# Altium schematic sheet CPU.SchDoc
size A3
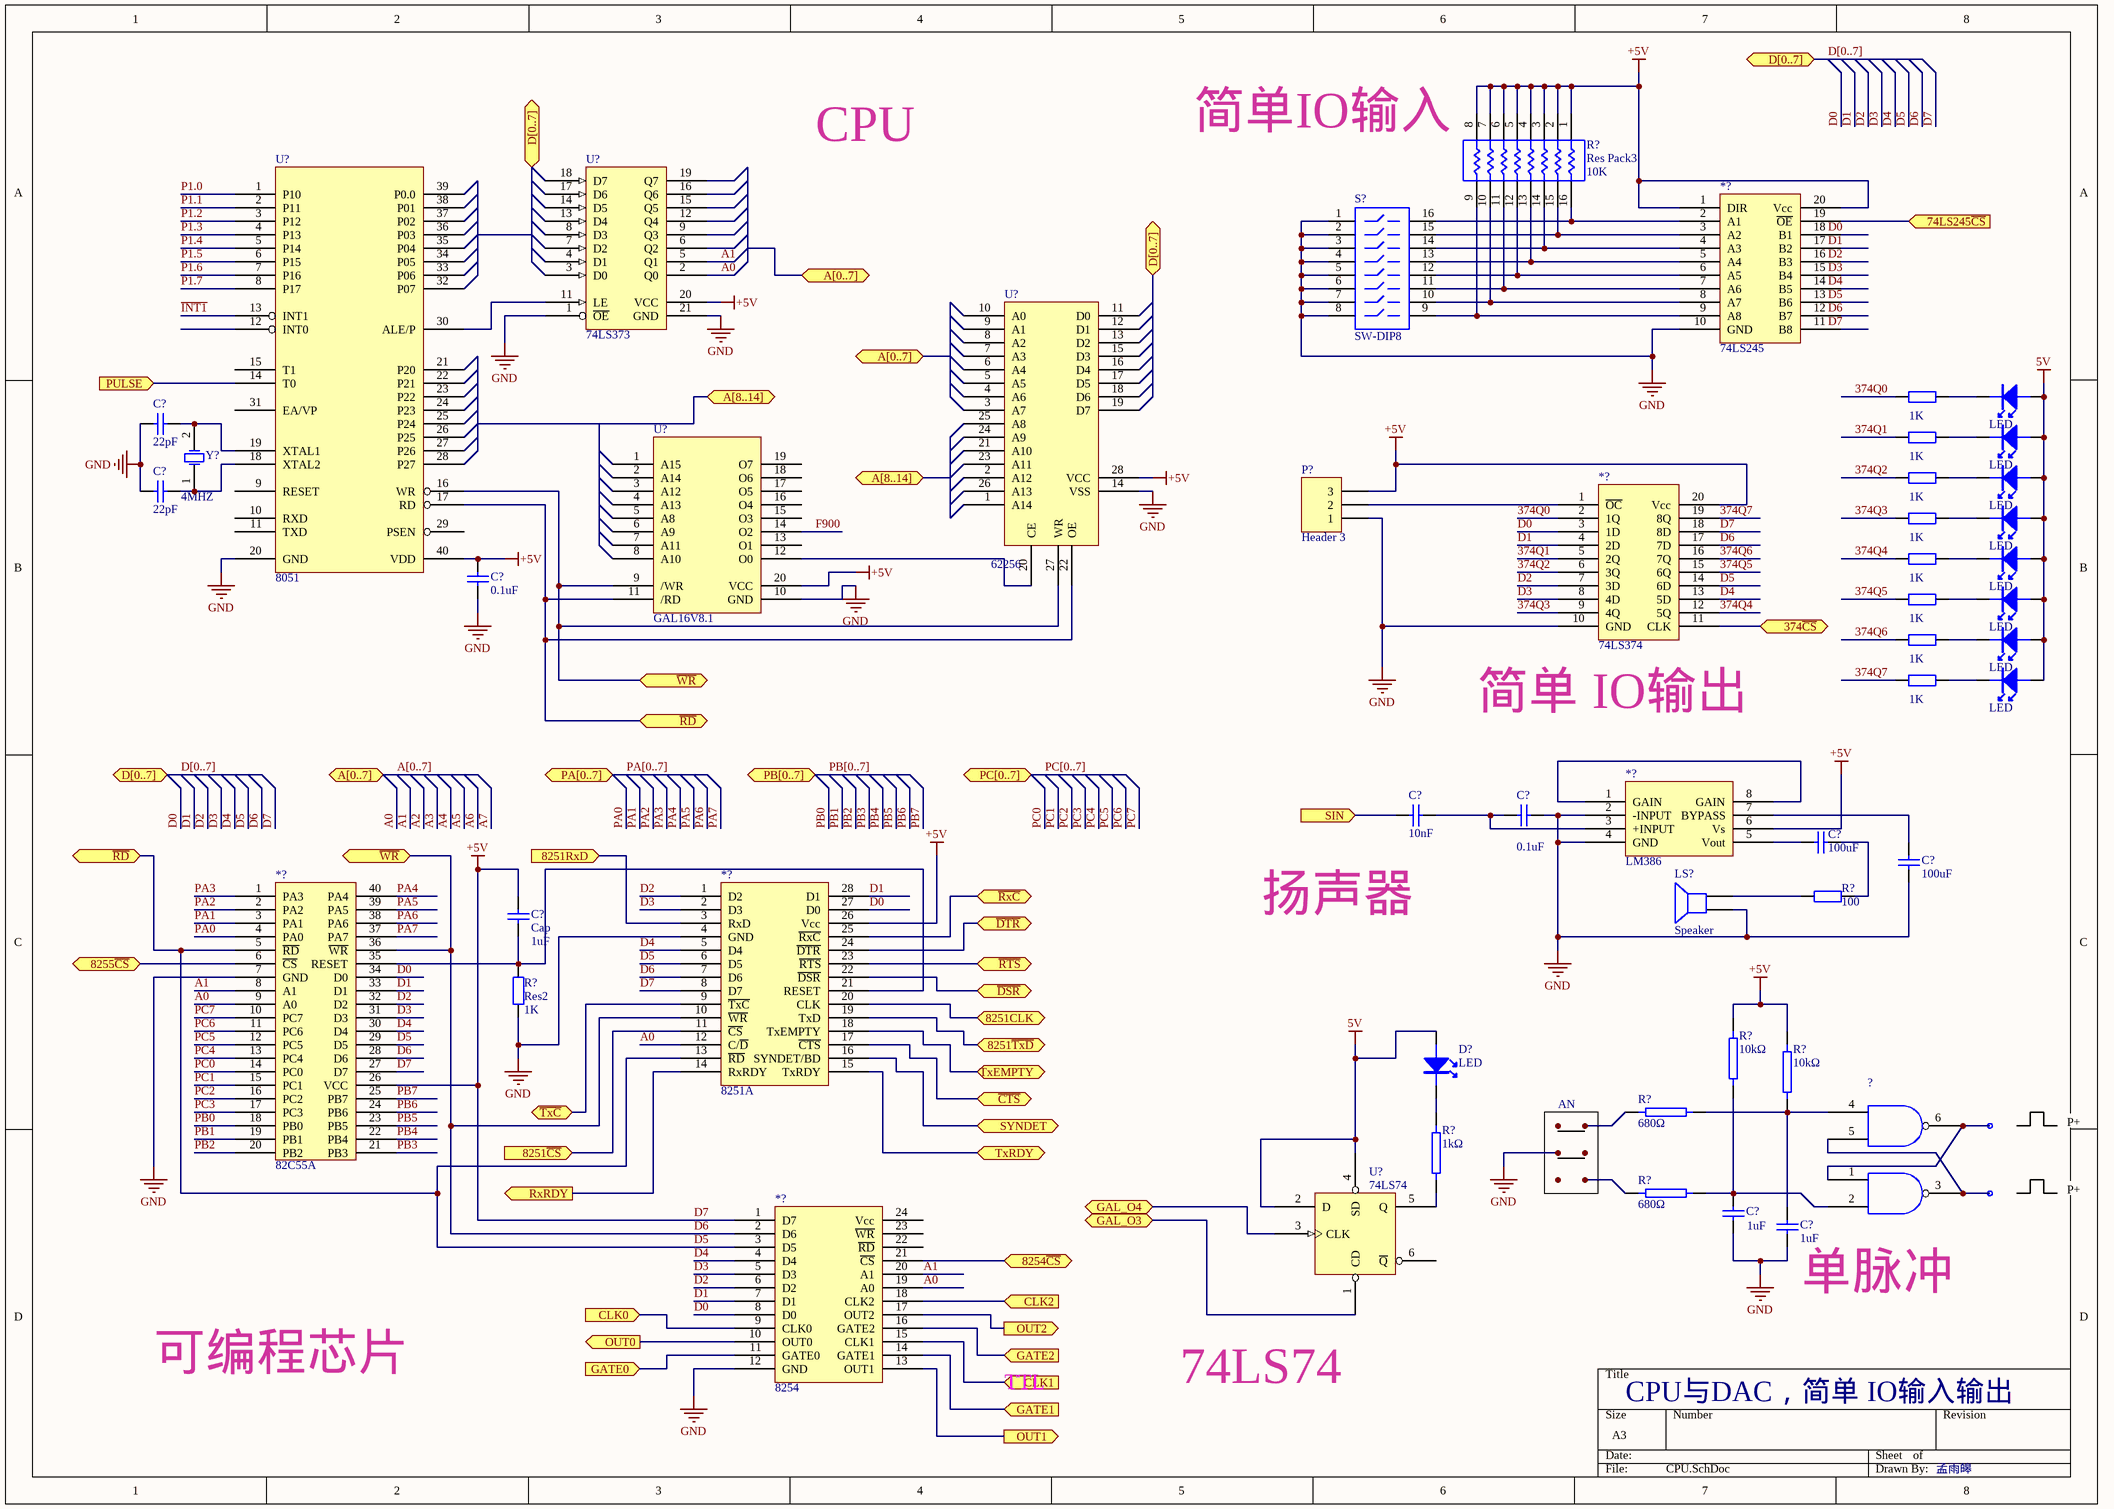
[diagram p0: CPU.SchDoc]

## Parts
(Parts that share a designator on the sheet are numbered #1, #2 ... from top to bottom, then left to right.)
*?#1  74LS245
*?#2  74LS374
*?#3  LM386
*?#4  8251A
*?#5  82C55A
*?#6  8254
?  74LS00  (value not drawn)
C?#1  value 22pF  [RAD-0.3]
C?#2  value 22pF  [RAD-0.3]
C?#3  value 0.1uF  [RAD-0.3]
C?#4  value 0.1uF  [RAD-0.3]
C?#5  value 10nF  [RAD-0.3]
C?#6  value 100uF  [RAD-0.3]
C?#7  value 100uF  [RAD-0.3]
C?#8  Cap  value 1uF  [RAD-0.3]
C?#9  value 1uF  [RAD-0.3]
C?#10  value 1uF  [RAD-0.3]
D?#1  LED
D?#2  LED
D?#3  LED
D?#4  LED
D?#5  LED
D?#6  LED
D?#7  LED
D?#8  LED
D?#9  LED
LS?  Speaker  [PIN2]
P?  Header 3  [HDR1X3]
R?#1  Res Pack3  value 10K  [SO-16_N]
R?#2  value 1K  [AXIAL-0.4]  (hidden comment: Res2)
R?#3  value 1K  [AXIAL-0.4]  (hidden comment: Res2)
R?#4  value 1K  [AXIAL-0.4]  (hidden comment: Res2)
R?#5  value 1K  [AXIAL-0.4]  (hidden comment: Res2)
R?#6  value 1K  [AXIAL-0.4]  (hidden comment: Res2)
R?#7  value 1K  [AXIAL-0.4]  (hidden comment: Res2)
R?#8  value 1K  [AXIAL-0.4]  (hidden comment: Res2)
R?#9  value 1K  [AXIAL-0.4]  (hidden comment: Res2)
R?#10  value 100  [AXIAL-0.4]
R?#11  Res2  value 1K  [AXIAL-0.4]
R?#12  10kΩ
R?#13  10kΩ
R?#14  680Ω
R?#15  1kΩ
R?#16  680Ω
S?  SW-DIP8  [DIP-16-KEY]
U?#1  74LS373
U?#2  62256
U?#3  8051
U?#4  GAL16V8.1
U?#5  74LS74
Y?  4MHZ  [crystals]

## Ports
74LS245~{CS} (in), 374~{CS}, 8251CLK, 8251RxD (in), 8251~{CS} (in), 8251~{TxD}, 8254~{CS}, 8255~{CS}, A[0..7], A[0..7] (bidir), A[8..14], CLK0 (in), CLK1 (in), CLK2 (in), D[0..7], D[0..7] (bidir), GAL_O3, GAL_O4, GATE0 (in), GATE1 (in), GATE2 (in), OUT0 (out), OUT1 (out), OUT2 (out), PA[0..7] (bidir), PB[0..7] (bidir), PC[0..7] (bidir), PULSE (in), RxRDY (out), SIN (in), SYNDET, TxEMPTY (bidir), TxRDY, ~{CTS}, ~{DSR}, ~{DTR} (bidir), ~{RD}, ~{RD} (bidir), ~{RTS} (bidir), ~{RxC}, ~{TxC}, ~{WR}

## Nets
5V: D?#1.1 D?#2.1 D?#3.1 D?#4.1 D?#5.1 D?#6.1 D?#7.1 D?#8.1 D?#9.1 U?#5.2(D) U?#5.4(SD)
D7: *?#1.1(DIR) *?#1.20(Vcc) *?#2.18(8D) *?#2.20(Vcc) *?#3.6(Vs) *?#4.8(D7) *?#4.26(Vcc) *?#5.26(VCC) *?#5.27(D7) *?#6.1(D7) C?#3.1 C?#8.1 P?.3 R?#1.1 R?#1.2 R?#1.3 R?#1.4 R?#1.5 R?#1.6 R?#1.7 R?#1.8 R?#12.2 R?#13.2 U?#1.20(VCC) U?#2.28(VCC) U?#3.40(VDD) U?#4.20(VCC)  [also labelled +5V]
GND: *?#1.10(GND) *?#2.10(GND) *?#3.2(-INPUT) *?#3.4(GND) *?#4.4(GND) *?#5.7(GND) *?#6.12(GND) C?#1.2 C?#2.2 C?#3.2 C?#4.2 C?#7.1 C?#9.1 C?#10.1 LS?.1 P?.1 R?#11.2 S?.1 S?.2 S?.3 S?.4 S?.5 S?.6 S?.7 S?.8 U?#1.1(~{OE}) U?#1.21(GND) U?#2.14(VSS) U?#3.20(GND) U?#4.10(GND)
74LS245~{CS}: *?#1.19(~{OE}) ; port 74LS245~{CS}
374~{CS}: *?#2.11(CLK) ; port 374~{CS}
374Q0: *?#2.2(1Q) R?#2.1
374Q1: *?#2.5(2Q) R?#3.1
374Q2: *?#2.6(3Q) R?#4.1
374Q3: *?#2.9(4Q) R?#5.1
374Q4: *?#2.12(5Q) R?#6.1
374Q5: *?#2.15(6Q) R?#7.1
374Q6: *?#2.16(7Q) R?#8.1
374Q7: *?#2.19(8Q) R?#9.1
8251~{CS}: *?#4.11(~{CS}) ; port 8251~{CS}
8251CLK: *?#4.20(CLK) ; port 8251CLK
8251RxD: *?#4.3(RxD) ; port 8251RxD
8251~{TxD}: *?#4.19(TxD) ; port 8251~{TxD}
8254~{CS}: *?#6.21(~{CS}) ; port 8254~{CS}
8255~{CS}: *?#5.6(~{CS}) ; port 8255~{CS}
A0: *?#4.12(C/~{D}) *?#5.9(A0) *?#6.19(A0) U?#1.2(Q0)
A1: *?#5.8(A1) *?#6.20(A1) U?#1.5(Q1)
~{CTS}: *?#4.17(~{CTS}) ; port ~{CTS}
CLK0: *?#6.9(CLK0) ; port CLK0
CLK1: *?#6.15(CLK1) ; port CLK1
CLK2: *?#6.18(CLK2) ; port CLK2
D0: *?#2.3(1D) *?#4.27(D0) *?#5.34(D0) *?#6.8(D0)
D1: *?#2.4(2D) *?#4.28(D1) *?#5.33(D1) *?#6.7(D1)
D2: *?#2.7(3D) *?#4.1(D2) *?#5.32(D2) *?#6.6(D2)
D3: *?#2.8(4D) *?#4.2(D3) *?#5.31(D3) *?#6.5(D3)
D4: *?#2.13(5D) *?#4.5(D4) *?#5.30(D4) *?#6.4(D4)
D5: *?#2.14(6D) *?#4.6(D5) *?#4.13(~{RD}) *?#5.5(~{RD}) *?#5.29(D5) *?#6.3(D5) U?#2.22(OE) U?#3.17(RD) U?#4.11(/RD) ; port ~{RD}
D6: *?#2.17(7D) *?#4.7(D6) *?#4.10(~{WR}) *?#5.28(D6) *?#5.36(~{WR}) *?#6.2(D6) U?#2.27(WR) U?#3.16(WR) U?#4.9(/WR) ; port ~{WR}
~{DSR}: *?#4.22(~{DSR}) ; port ~{DSR}
~{DTR}: *?#4.24(~{DTR}) ; port ~{DTR}
F900: U?#4.14(O2)
GAL_O3: U?#5.1(CD) ; port GAL_O3
GAL_O4: U?#5.3(CLK) ; port GAL_O4
GATE0: *?#6.11(GATE0) ; port GATE0
GATE1: *?#6.14(GATE1) ; port GATE1
GATE2: *?#6.16(GATE2) ; port GATE2
~{INT1}: U?#3.13(INT1)
OUT0: *?#6.10(OUT0) ; port OUT0
OUT1: *?#6.13(OUT1) ; port OUT1
OUT2: *?#6.17(OUT2) ; port OUT2
P1.0: U?#3.1(P10)
P1.1: U?#3.2(P11)
P1.2: U?#3.3(P12)
P1.3: U?#3.4(P13)
P1.4: U?#3.5(P14)
P1.5: U?#3.6(P15)
P1.6: U?#3.7(P16)
P1.7: U?#3.8(P17)
PA0: *?#5.4(PA0)
PA1: *?#5.3(PA1)
PA2: *?#5.2(PA2)
PA3: *?#5.1(PA3)
PA4: *?#5.40(PA4)
PA5: *?#5.39(PA5)
PA6: *?#5.38(PA6)
PA7: *?#5.37(PA7)
PB0: *?#5.18(PB0)
PB1: *?#5.19(PB1)
PB2: *?#5.20(PB2)
PB3: *?#5.21(PB3)
PB4: *?#5.22(PB4)
PB5: *?#5.23(PB5)
PB6: *?#5.24(PB6)
PB7: *?#5.25(PB7)
PC0: *?#5.14(PC0)
PC1: *?#5.15(PC1)
PC2: *?#5.16(PC2)
PC3: *?#5.17(PC3)
PC4: *?#5.13(PC4)
PC5: *?#5.12(PC5)
PC6: *?#5.11(PC6)
PC7: *?#5.10(PC7)
PULSE: U?#3.14(T0) ; port PULSE
~{RTS}: *?#4.23(~{RTS}) ; port ~{RTS}
~{RxC}: *?#4.25(~{RxC}) ; port ~{RxC}
RxRDY: *?#4.14(RxRDY) ; port RxRDY
SIN: C?#5.2 ; port SIN
SYNDET: *?#4.16(SYNDET/BD) ; port SYNDET
~{TxC}: *?#4.9(~{TxC}) ; port ~{TxC}
TxEMPTY: *?#4.18(TxEMPTY) ; port TxEMPTY
TxRDY: *?#4.15(TxRDY) ; port TxRDY
Net*?#1_2: *?#1.2(A1) R?#1.16 S?.16
Net*?#1_3: *?#1.3(A2) R?#1.15 S?.15
Net*?#1_4: *?#1.4(A3) R?#1.14 S?.14
Net*?#1_5: *?#1.5(A4) R?#1.13 S?.13
Net*?#1_6: *?#1.6(A5) R?#1.12 S?.12
Net*?#1_7: *?#1.7(A6) R?#1.11 S?.11
Net*?#1_8: *?#1.8(A7) R?#1.10 S?.10
Net*?#1_9: *?#1.9(A8) R?#1.9 S?.9
Net*?#2_1: *?#2.1(~{OC}) P?.2
Net*?#3_1: *?#3.1(GAIN) *?#3.8(GAIN)
Net*?#3_3: *?#3.3(+INPUT) C?#4.1 C?#5.1
Net*?#3_5: *?#3.5(Vout) C?#6.1
Net*?#3_7: *?#3.7(BYPASS) C?#7.2
Net*?#4_21: *?#4.21(RESET) *?#5.35(RESET) C?#8.2 R?#11.1
Net?_1: ?.1 ?.6
Net?_2: ?.2 C?#9.2 R?#12.1 R?#16.2
Net?_3: ?.3 ?.5
Net?_4: ?.4 C?#10.2 R?#13.1 R?#14.2
NetC?#1_1: C?#1.1 U?#3.19(XTAL1) Y?.2(OSC2)
NetC?#2_1: C?#2.1 U?#3.18(XTAL2) Y?.1(OSC1)
NetC?#6_2: C?#6.2 R?#10.2
NetD?#1_2: D?#1.2 R?#2.2
NetD?#2_2: D?#2.2 R?#3.2
NetD?#3_2: D?#3.2 R?#4.2
NetD?#4_2: D?#4.2 R?#5.2
NetD?#5_2: D?#5.2 R?#6.2
NetD?#6_2: D?#6.2 R?#7.2
NetD?#7_2: D?#7.2 R?#8.2
NetD?#8_2: D?#8.2 R?#9.2
NetD?#9_2: D?#9.2 R?#15.2
NetLS?_2: LS?.2 R?#10.1
NetR?#15_1: R?#15.1 U?#5.5(Q)
NetU?#1_11: U?#1.11(LE) U?#3.30(ALE/P)
NetU?#2_20: U?#2.20(CE) U?#4.12(O0)

Not connected (* = marked no-connect by the designer): *?#1 11(B8) 12(B7) 13(B6) 14(B5) 15(B4) 16(B3) 17(B2) 18(B1); *?#6 22(~{RD}) 23(~{WR}) 24(Vcc); R?#14 1; R?#16 1; U?#1 3(D0) 4(D1) 6(Q2) 7(D2) 8(D3) 9(Q3) 12(Q4) 13(D4) 14(D5) 15(Q5) 16(Q6) 17(D6) 18(D7) 19(Q7); U?#2 1(A14) 2(A12) 3(A7) 4(A6) 5(A5) 6(A4) 7(A3) 8(A2) 9(A1) 10(A0) 11(D0) 12(D1) 13(D2) 15(D3) 16(D4) 17(D5) 18(D6) 19(D7) 21(A10) 23(A11) 24(A9) 25(A8) 26(A13); U?#3 9(RESET) 10(RXD) 11(TXD) 12(INT0) 15(T1) 21(P20) 22(P21) 23(P22) 24(P23) 25(P24) 26(P25) 27(P26) 28(P27) 29(PSEN) 31(EA/VP) 32(P07) 33(P06) 34(P05) 35(P04) 36(P03) 37(P02) 38(P01) 39(P0.0); U?#4 1(A15) 2(A14) 3(A12) 4(A13) 5(A8) 6(A9) 7(A11) 8(A10) 13(O1) 15(O3) 16(O4) 17(O5) 18(O6) 19(O7); U?#5 6(~{Q})

## Buses and harness runs
bus A[0..7] = port A[0..7]
bus D[0..7] = port D[0..7]
bus PA[0..7] = port PA[0..7]
bus PB[0..7] = port PB[0..7]
bus PC[0..7] = port PC[0..7]

## Notes on the sheet
- CPU
- 简单IO输入
- (near *?#2) 简单 IO输出
- 扬声器
- AN
- P+
- (near C?#10) 单脉冲
- 可编程芯片
- TTL
- 74LS74
- CPU与DAC，简单 IO输入输出
- 孟雨皞
- Labels drawn without touching a wire or pin: D0, D1, D2, D3, D4, D5, D6, D7

## Library data of the parts
C?#1-C?#10 = Cap: Capacitor; Published: 8-Jun-2000; LatestRevisionDate: 17-Jul-2002; LatestRevisionNote: Re-released for DXP Platform.; PackageReference: RAD-0.3; Publisher: Altium Limited
  C?#8: PackageDescription: Radial Cap, Thru-Hole; 2 Leads; 0.3 in Pin Spacing
LS? = Speaker: Loudspeaker; Published: 24-Mar-1999; LatestRevisionDate: 17-Jul-2002; LatestRevisionNote: Re-released for DXP Platform.; PackageReference: PIN2; Publisher: Altium Limited
P? = Header 3: Header, 3-Pin; LatestRevisionDate: 17-Jul-2002; LatestRevisionNote: Re-released for DXP Platform.; Publisher: Altium Limited
R?#1 = Res Pack3: Isolated Resistor Network; Published: 24-Mar-1999; LatestRevisionDate: 29-May-2009; LatestRevisionNote: IPC-7351 Footprint Added.; PackageReference: SO-16; Publisher: Altium Limited; PackageDescription: 16-Pin Small Outline Integrated Circuit 1.27 mm Pitch; Code_JEDEC: MS-012-AC; Code_IPC: SOIC127P600-16
R?#2-R?#11 = Res2: Resistor; Published: 8-Jun-2000; LatestRevisionDate: 17-Jul-2002; LatestRevisionNote: Re-released for DXP Platform.; PackageReference: AXIAL-0.4; Publisher: Altium Limited
  R?#2-R?#9 R?#11: PackageDescription: Axial Device, Thru-Hole; 2 Leads; 0.4 in Pin Spacing
R?#12-R?#16 = 电阻
S? = SW-DIP8: 4009 Series DIP Switch, Raised actuator; Published: 24-Mar-1999; LatestRevisionDate: 17-Dec-2003; LatestRevisionNote: PCB Footprint replaced.; PackageReference: DIP-16-KEY; Publisher: Altium Limited; PackageDescription: DIP; 16 Leads; Row Spacing 7.62 mm; Pitch 2.54 mm; ComponentLink1Description: Manufacturer Link; ComponentLink1URL: http://www.oupiin.com/prodindx.html#Headers
Y? = XTAL: Crystal Oscillator; Published: 8-Jun-2000; LatestRevisionDate: 17-Jul-2002; LatestRevisionNote: Re-released for DXP Platform.; PackageReference: R38; Publisher: Altium Limited